# Altium project MagnetGen-Controller.PrjPcb
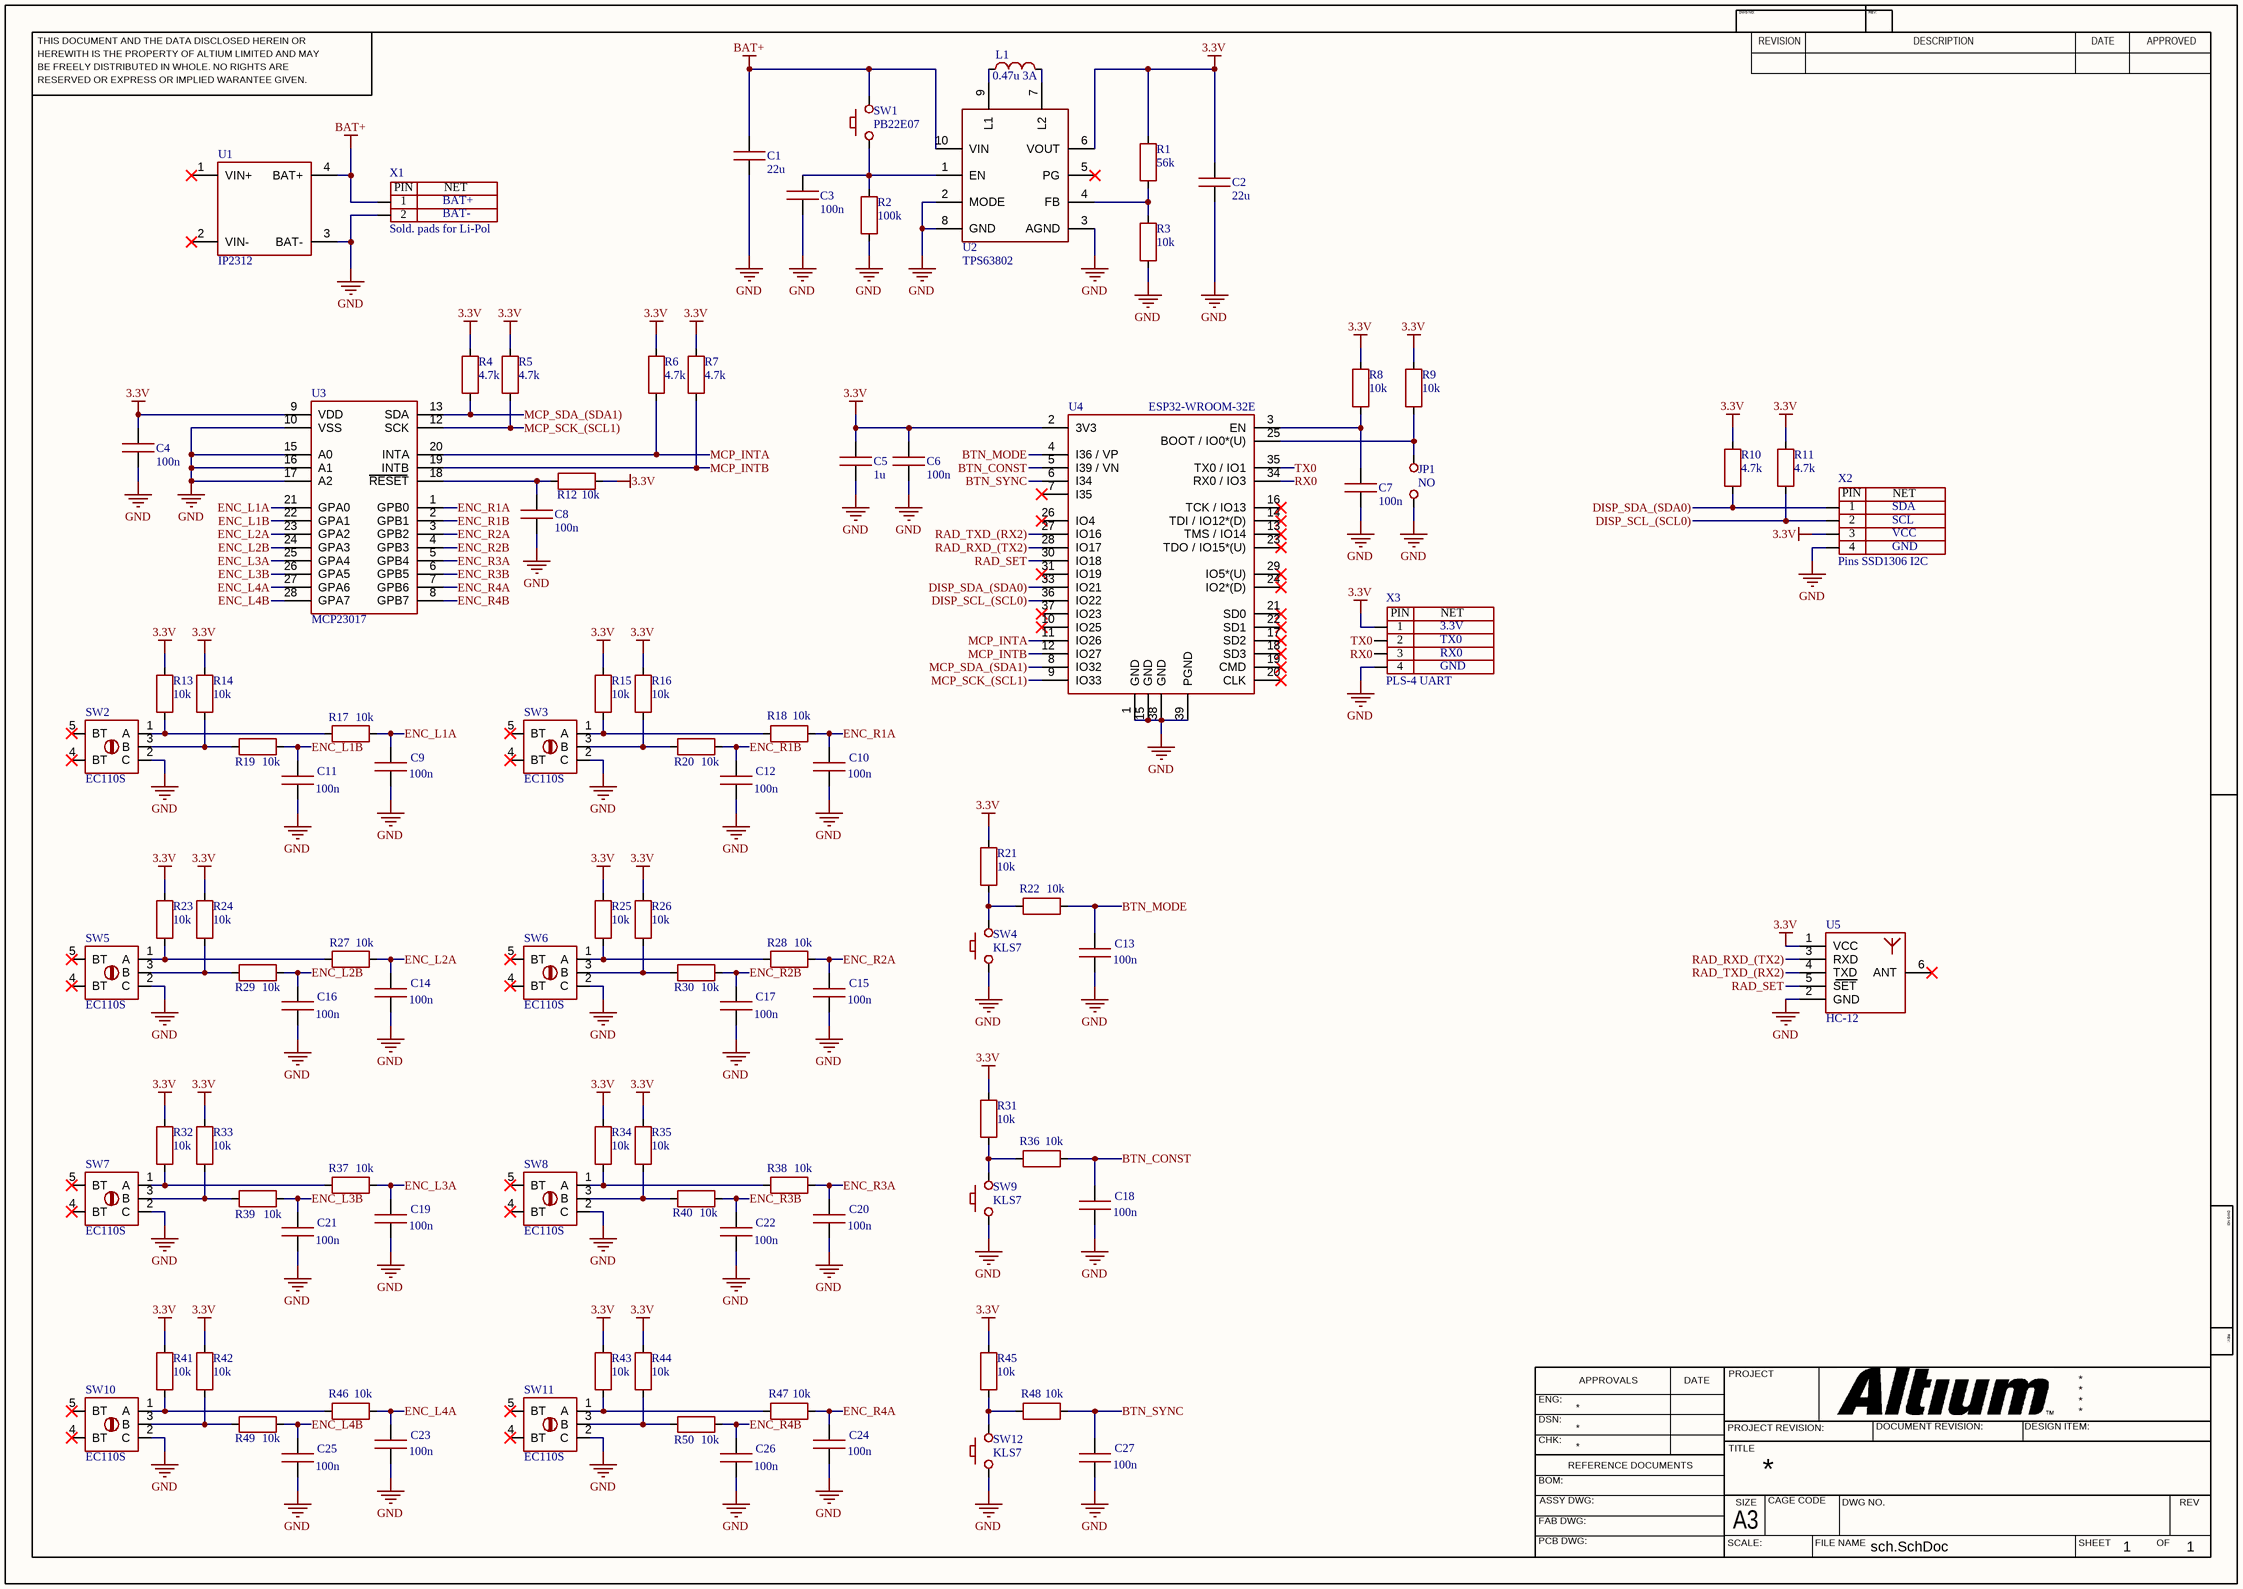
[diagram p0: sch.SchDoc]
1 sheet, 99 parts. Net scope: global (net labels, ports and power ports of the same name join across sheets).
Board file: PCB_V1.PcbDoc

## Sheet sch.SchDoc
size 420 x 297 mm; SheetNumber: 1; SheetTotal: 1

### Parts
C1  22u  [C1210]
C2  22u  [C1210]
C3  100n  [C0402]
C4  100n  [C0402]
C5  1u  [C0603]
C6  100n  [C0402]
C7  100n  [C0402]
C8  100n  [C0402]
C9  100n  [C0402]
C10  100n  [C0402]
C11  100n  [C0402]
C12  100n  [C0402]
C13  100n  [C0402]
C14  100n  [C0402]
C15  100n  [C0402]
C16  100n  [C0402]
C17  100n  [C0402]
C18  100n  [C0402]
C19  100n  [C0402]
C20  100n  [C0402]
C21  100n  [C0402]
C22  100n  [C0402]
C23  100n  [C0402]
C24  100n  [C0402]
C25  100n  [C0402]
C26  100n  [C0402]
C27  100n  [C0402]
JP1  NO  [jumper 3mm]
L1  0.47u 3A  [INDUCTOR 2x1.6mm VLS-CX]
R1  56k  [R0402]
R2  100k  [R0402]
R3  10k  [R0402]
R4  4.7k  [R0402]
R5  4.7k  [R0402]
R6  4.7k  [R0402]
R7  4.7k  [R0402]
R8  10k  [R0402]
R9  10k  [R0402]
R10  4.7k  [R0402]
R11  4.7k  [R0402]
R12  10k  [R0402]
R13  10k  [R0402]
R14  10k  [R0402]
R15  10k  [R0402]
R16  10k  [R0402]
R17  10k  [R0402]
R18  10k  [R0402]
R19  10k  [R0402]
R20  10k  [R0402]
R21  10k  [R0402]
R22  10k  [R0402]
R23  10k  [R0402]
R24  10k  [R0402]
R25  10k  [R0402]
R26  10k  [R0402]
R27  10k  [R0402]
R28  10k  [R0402]
R29  10k  [R0402]
R30  10k  [R0402]
R31  10k  [R0402]
R32  10k  [R0402]
R33  10k  [R0402]
R34  10k  [R0402]
R35  10k  [R0402]
R36  10k  [R0402]
R37  10k  [R0402]
R38  10k  [R0402]
R39  10k  [R0402]
R40  10k  [R0402]
R41  10k  [R0402]
R42  10k  [R0402]
R43  10k  [R0402]
R44  10k  [R0402]
R45  10k  [R0402]
R46  10k  [R0402]
R47  10k  [R0402]
R48  10k  [R0402]
R49  10k  [R0402]
R50  10k  [R0402]
SW1  PB22E07  [PB22E07 7х7х12]
SW2  EC110S  [EC110S(ЭНКОДЕР)]
SW3  EC110S  [EC110S(ЭНКОДЕР)]
SW4  KLS7  [SMT Tactile Switch (6mm x 6mm)]
SW5  EC110S  [EC110S(ЭНКОДЕР)]
SW6  EC110S  [EC110S(ЭНКОДЕР)]
SW7  EC110S  [EC110S(ЭНКОДЕР)]
SW8  EC110S  [EC110S(ЭНКОДЕР)]
SW9  KLS7  [SMT Tactile Switch (6mm x 6mm)]
SW10  EC110S  [EC110S(ЭНКОДЕР)]
SW11  EC110S  [EC110S(ЭНКОДЕР)]
SW12  KLS7  [SMT Tactile Switch (6mm x 6mm)]
U1  IP2312  [IP2312 Modul]
U2  TPS63802  [VSON-HR-10(3x2)]
U3  MCP23017  [SSOP-28N]
U4  ESP32-WROOM-32E  [ESP32­WROOM­32E]
U5  HC-12  [HC-12(Модуль)]
X1  Sold. pads for Li-Pol  [CWF-2R (DS1069-2 MR)]
X2  Pins SSD1306 I2C  [SSD1306 27.5x27.8 NO GABARIT]
X3  PLS-4 UART  [PLS-4]

### Nets
3.3V: C2.2 C4.2 C5.2 C6.2 R1.2 R4.2 R5.2 R6.2 R7.2 R8.2 R9.2 R10.2 R11.2 R12.1 R13.1 R14.1 R15.1 R16.1 R21.2 R23.1 R24.1 R25.1 R26.1 R31.2 R32.1 R33.1 R34.1 R35.1 R41.1 R42.1 R43.1 R44.1 R45.2 U2.6(VOUT) U3.9(VDD) U4.2(3V3) U5.1(VCC) X2.3(NET3) X3.1(NET1)
BAT+: C1.2 SW1.2 U1.4(BAT+) U2.10(VIN) X1.1(NET1)
GND: C1.1 C2.1 C3.1 C4.1 C5.1 C6.1 C7.1 C8.1 C9.1 C10.1 C11.1 C12.1 C13.1 C14.1 C15.1 C16.1 C17.1 C18.1 C19.1 C20.1 C21.1 C22.1 C23.1 C24.1 C25.1 C26.1 C27.1 JP1.1 R2.1 R3.1 SW2.2(C) SW3.2(C) SW4.1 SW5.2(C) SW6.2(C) SW7.2(C) SW8.2(C) SW9.1 SW10.2(C) SW11.2(C) SW12.1 U1.3(BAT-) U2.2(MODE) U2.3(AGND) U2.8(GND) U3.10(VSS) U3.15(A0) U3.16(A1) U3.17(A2) U4.1(GND) U4.15(GND) U4.38(GND) U4.39(PGND) U5.2(GND) X1.2(NET2) X2.4(NET4) X3.4(NET4)
BTN_CONST: C18.2 R36.1 U4.5(I39_/_VN)
BTN_MODE: C13.2 R22.1 U4.4(I36_/_VP)
BTN_SYNC: C27.2 R48.1 U4.6(I34)
DISP_SCL_(SCL0): R11.1 U4.36(IO22) X2.2(NET2)
DISP_SDA_(SDA0): R10.1 U4.33(IO21) X2.1(NET1)
ENC_L1A: C9.2 R17.1 U3.21(GPA0)
ENC_L1B: C11.2 R19.1 U3.22(GPA1)
ENC_L2A: C14.2 R27.1 U3.23(GPA2)
ENC_L2B: C16.2 R29.1 U3.24(GPA3)
ENC_L3A: C19.2 R37.1 U3.25(GPA4)
ENC_L3B: C21.2 R39.1 U3.26(GPA5)
ENC_L4A: C23.2 R46.1 U3.27(GPA6)
ENC_L4B: C25.2 R49.1 U3.28(GPA7)
ENC_R1A: C10.2 R18.1 U3.1(GPB0)
ENC_R1B: C12.2 R20.1 U3.2(GPB1)
ENC_R2A: C15.2 R28.1 U3.3(GPB2)
ENC_R2B: C17.2 R30.1 U3.4(GPB3)
ENC_R3A: C20.2 R38.1 U3.5(GPB4)
ENC_R3B: C22.2 R40.1 U3.6(GPB5)
ENC_R4A: C24.2 R47.1 U3.7(GPB6)
ENC_R4B: C26.2 R50.1 U3.8(GPB7)
MCP_INTA: R6.1 U3.20(INTA) U4.11(IO26)
MCP_INTB: R7.1 U3.19(INTB) U4.12(IO27)
MCP_SCK_(SCL1): R5.1 U3.12(SCK) U4.9(IO33)
MCP_SDA_(SDA1): R4.1 U3.13(SDA) U4.8(IO32)
RAD_RXD_(TX2): U4.28(IO17) U5.3(RXD)
RAD_SET: U4.30(IO18) U5.5(SET)
RAD_TXD_(RX2): U4.27(IO16) U5.4(TXD)
RX0: U4.34(RX0_/_IO3) X3.3(NET3)
TX0: U4.35(TX0_/_IO1) X3.2(NET2)
NetC3_2: C3.2 R2.2 SW1.1 U2.1(EN)
NetC7_2: C7.2 R8.1 U4.3(EN)
NetC8_2: C8.2 R12.2 U3.18(RESET)
NetJP1_2: JP1.2 R9.1 U4.25(BOOT_/_IO0*(U))
NetL1_1: L1.1 U2.9(L1)
NetL1_2: L1.2 U2.7(L2)
NetR1_1: R1.1 R3.2 U2.4(FB)
NetR13_2: R13.2 R17.2 SW2.1(A)
NetR14_2: R14.2 R19.2 SW2.3(B)
NetR15_2: R15.2 R18.2 SW3.1(A)
NetR16_2: R16.2 R20.2 SW3.3(B)
NetR21_1: R21.1 R22.2 SW4.2
NetR23_2: R23.2 R27.2 SW5.1(A)
NetR24_2: R24.2 R29.2 SW5.3(B)
NetR25_2: R25.2 R28.2 SW6.1(A)
NetR26_2: R26.2 R30.2 SW6.3(B)
NetR31_1: R31.1 R36.2 SW9.2
NetR32_2: R32.2 R37.2 SW7.1(A)
NetR33_2: R33.2 R39.2 SW7.3(B)
NetR34_2: R34.2 R38.2 SW8.1(A)
NetR35_2: R35.2 R40.2 SW8.3(B)
NetR41_2: R41.2 R46.2 SW10.1(A)
NetR42_2: R42.2 R49.2 SW10.3(B)
NetR43_2: R43.2 R47.2 SW11.1(A)
NetR44_2: R44.2 R50.2 SW11.3(B)
NetR45_1: R45.1 R48.2 SW12.2

Not connected (* = marked no-connect by the designer): SW2 4(BT)* 5(BT)*; SW3 4(BT)* 5(BT)*; SW5 4(BT)* 5(BT)*; SW6 4(BT)* 5(BT)*; SW7 4(BT)* 5(BT)*; SW8 4(BT)* 5(BT)*; SW10 4(BT)* 5(BT)*; SW11 4(BT)* 5(BT)*; U1 1(VIN+)* 2(VIN-)*; U2 5(PG)*; U4 7(I35)* 10(IO25)* 13(TMS_/_IO14)* 14(TDI_/_IO12*(D))* 16(TCK_/_IO13)* 17(SD2)* 18(SD3)* 19(CMD)* 20(CLK)* 21(SD0)* 22(SD1)* 23(TDO_/_IO15*(U))* 24(IO2*(D))* 26(IO4)* 29(IO5*(U))* 31(IO19)* 37(IO23)*; U5 6(ANT)*

### Notes on the sheet
- (near X1) BAT+
- (near X1) BAT-
- (near X2) SDA
- (near X2) SCL
- (near X2) GND
- (near X2) VCC
- (near X3) 3.3V
- (near X3) TX0
- (near X3) RX0
- (near X3) GND
- THIS DOCUMENT AND THE DATA DISCLOSED HEREIN OR
- HEREWITH IS THE PROPERTY OF ALTIUM LIMITED AND MAY
- DWG NO:
- REVISION
- REV:
- DESCRIPTION
- DATE
- APPROVED
- BE FREELY DISTRIBUTED IN WHOLE. NO RIGHTS ARE
- RESERVED OR EXPRESS OR IMPLIED WARANTEE GIVEN.
- ENG:
- APPROVALS
- PROJECT
- DSN:
- CHK:
- REFERENCE DOCUMENTS
- PROJECT REVISION:
- TITLE
- DOCUMENT REVISION:
- DESIGN ITEM:
- BOM:
- FAB DWG:
- PCB DWG:
- ASSY DWG:
- SCALE:
- A3
- SIZE
- CAGE CODE
- FILE NAME
- DWG NO.
- SHEET
- OF
- REV
- (in symbol Terminal block (2-pin)) PIN; NET
- (in symbol Terminal block (4-pin)) PIN; NET

### Library data of the parts
C1 C2 = Capacitor: 22 мкФ X7R 10% 25В 1210, GRM32ER71E226KE15L; ClassName: impulse reg
C3 C4 C6-C27 = Capacitor: 0.1 мкФ X7R 25В 10% 0402, GRM155R71E104KE14D
  C3: ClassName: impulse reg
C5 = Capacitor: 1 мкФ X7R 25В 10% 0603, GCM188R71E105KA64D
JP1 = Jumper (Normal Open)
L1 = Inductance: VLS201610CX-R47M-1, 0.47мкГн, 3.16А; ClassName: impulse reg
R1-R50 = Resistor: 0402
  R1-R3: ClassName: impulse reg
SW1 = Switch Button (Normal Open): PB22E07 с фиксацией 7x7x12 mm
SW2 SW3 SW5-SW8 SW10 SW11 = Encoder (Incremental, with Button): Incremental Encoder with button / EC110S 20/20 10mm
SW4 SW9 SW12 = Switch Button (Normal Open): KLS7-TS6604-4.3-180 (IT-1102S) 6х6х4.3мм
U1 = MOD_Charger_IP2312: Impulse charger without protection; ClassName: impulse reg
U2 = IC_ImpRegulator_TPS63802: Integral Buck-Boost Regulator 2A out; ClassName: impulse reg
U3 = IC_PortsExp_MCP23017: 16-Bit I/O Expander with Serial Interface
U4 = MOD_ESP32-WROOM-32
U5 = MOD_RadioMod_HC-12: Radio module 433MHz UART Interface
X1 = Terminal block (2-pin): ClassName: impulse reg
X2 X3 = Terminal block (4-pin)